# Altium schematic sheet FPGA_Banks2.SchDoc: FPGA Banks 2
size A4; Engineer: Samer Kilani; DocumentNumber: 7; SheetNumber: 7; SheetTotal: 9
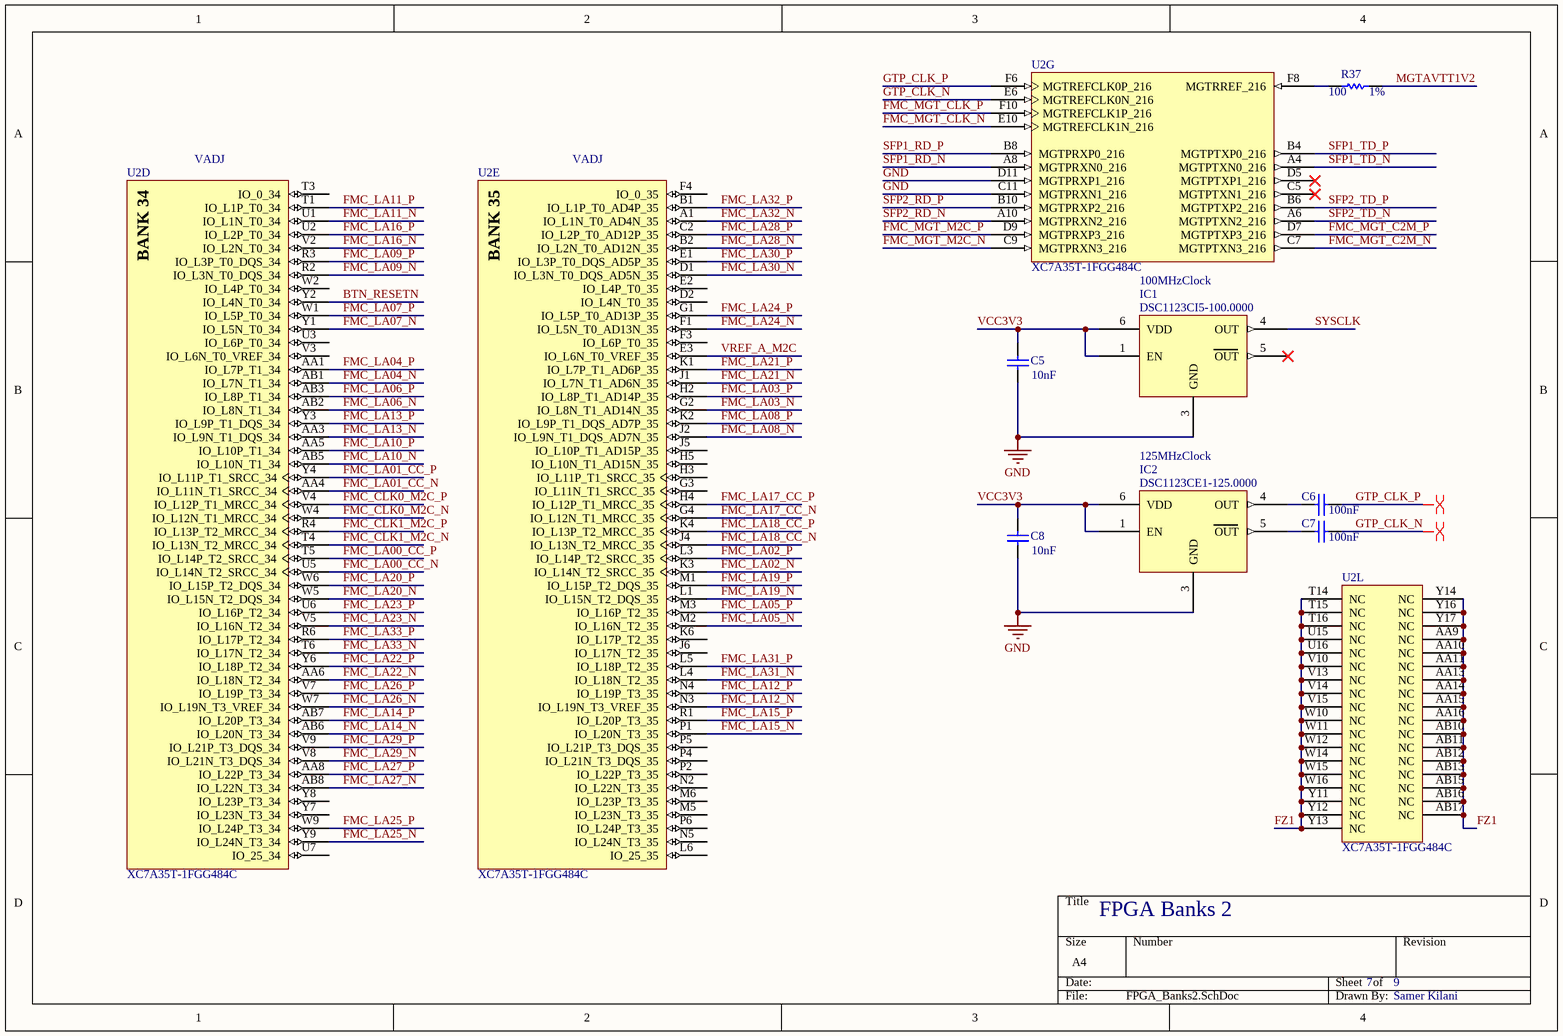
[diagram p0: FPGA_Banks2.SchDoc]

## Parts
C5  value 10nF  [C0402]  (hidden comment: Cap)
C6  value 100nF  [C0402]  (hidden comment: Cap)
C7  value 100nF  [C0402]  (hidden comment: Cap)
C8  value 10nF  [C0402]  (hidden comment: Cap)
IC1  DSC1123CI5-100.0000  [DSC1123_32_25]
IC2  DSC1123CE1-125.0000  [DSC1123_32_25]
R37  value 100  Tolerance: 1%  [R0402]  (hidden comment: Res)
U2  XC7A35T-1FGG484C  [FGG484]  (parts D,E,G,L of 12)

## Nets
GND: C5.1 C8.1 IC1.3(GND) IC2.3(GND) U2.C11(MGTPRXN1_216) U2.D11(MGTPRXP1_216)
BTN_RESETN: U2.Y2(IO_L4N_T0_34)
FMC_CLK0_M2C_N: U2.W4(IO_L12N_T1_MRCC_34)
FMC_CLK0_M2C_P: U2.V4(IO_L12P_T1_MRCC_34)
FMC_CLK1_M2C_N: U2.T4(IO_L13N_T2_MRCC_34)
FMC_CLK1_M2C_P: U2.R4(IO_L13P_T2_MRCC_34)
FMC_LA00_CC_N: U2.U5(IO_L14N_T2_SRCC_34)
FMC_LA00_CC_P: U2.T5(IO_L14P_T2_SRCC_34)
FMC_LA01_CC_N: U2.AA4(IO_L11N_T1_SRCC_34)
FMC_LA01_CC_P: U2.Y4(IO_L11P_T1_SRCC_34)
FMC_LA02_N: U2.K3(IO_L14N_T2_SRCC_35)
FMC_LA02_P: U2.L3(IO_L14P_T2_SRCC_35)
FMC_LA03_N: U2.G2(IO_L8N_T1_AD14N_35)
FMC_LA03_P: U2.H2(IO_L8P_T1_AD14P_35)
FMC_LA04_N: U2.AB1(IO_L7N_T1_34)
FMC_LA04_P: U2.AA1(IO_L7P_T1_34)
FMC_LA05_N: U2.M2(IO_L16N_T2_35)
FMC_LA05_P: U2.M3(IO_L16P_T2_35)
FMC_LA06_N: U2.AB2(IO_L8N_T1_34)
FMC_LA06_P: U2.AB3(IO_L8P_T1_34)
FMC_LA07_N: U2.Y1(IO_L5N_T0_34)
FMC_LA07_P: U2.W1(IO_L5P_T0_34)
FMC_LA08_N: U2.J2(IO_L9N_T1_DQS_AD7N_35)
FMC_LA08_P: U2.K2(IO_L9P_T1_DQS_AD7P_35)
FMC_LA09_N: U2.R2(IO_L3N_T0_DQS_34)
FMC_LA09_P: U2.R3(IO_L3P_T0_DQS_34)
FMC_LA10_N: U2.AB5(IO_L10N_T1_34)
FMC_LA10_P: U2.AA5(IO_L10P_T1_34)
FMC_LA11_N: U2.U1(IO_L1N_T0_34)
FMC_LA11_P: U2.T1(IO_L1P_T0_34)
FMC_LA12_N: U2.N3(IO_L19N_T3_VREF_35)
FMC_LA12_P: U2.N4(IO_L19P_T3_35)
FMC_LA13_N: U2.AA3(IO_L9N_T1_DQS_34)
FMC_LA13_P: U2.Y3(IO_L9P_T1_DQS_34)
FMC_LA14_N: U2.AB6(IO_L20N_T3_34)
FMC_LA14_P: U2.AB7(IO_L20P_T3_34)
FMC_LA15_N: U2.P1(IO_L20N_T3_35)
FMC_LA15_P: U2.R1(IO_L20P_T3_35)
FMC_LA16_N: U2.V2(IO_L2N_T0_34)
FMC_LA16_P: U2.U2(IO_L2P_T0_34)
FMC_LA17_CC_N: U2.G4(IO_L12N_T1_MRCC_35)
FMC_LA17_CC_P: U2.H4(IO_L12P_T1_MRCC_35)
FMC_LA18_CC_N: U2.J4(IO_L13N_T2_MRCC_35)
FMC_LA18_CC_P: U2.K4(IO_L13P_T2_MRCC_35)
FMC_LA19_N: U2.L1(IO_L15N_T2_DQS_35)
FMC_LA19_P: U2.M1(IO_L15P_T2_DQS_35)
FMC_LA20_N: U2.W5(IO_L15N_T2_DQS_34)
FMC_LA20_P: U2.W6(IO_L15P_T2_DQS_34)
FMC_LA21_N: U2.J1(IO_L7N_T1_AD6N_35)
FMC_LA21_P: U2.K1(IO_L7P_T1_AD6P_35)
FMC_LA22_N: U2.AA6(IO_L18N_T2_34)
FMC_LA22_P: U2.Y6(IO_L18P_T2_34)
FMC_LA23_N: U2.V5(IO_L16N_T2_34)
FMC_LA23_P: U2.U6(IO_L16P_T2_34)
FMC_LA24_N: U2.F1(IO_L5N_T0_AD13N_35)
FMC_LA24_P: U2.G1(IO_L5P_T0_AD13P_35)
FMC_LA25_N: U2.Y9(IO_L24N_T3_34)
FMC_LA25_P: U2.W9(IO_L24P_T3_34)
FMC_LA26_N: U2.W7(IO_L19N_T3_VREF_34)
FMC_LA26_P: U2.V7(IO_L19P_T3_34)
FMC_LA27_N: U2.AB8(IO_L22N_T3_34)
FMC_LA27_P: U2.AA8(IO_L22P_T3_34)
FMC_LA28_N: U2.B2(IO_L2N_T0_AD12N_35)
FMC_LA28_P: U2.C2(IO_L2P_T0_AD12P_35)
FMC_LA29_N: U2.V8(IO_L21N_T3_DQS_34)
FMC_LA29_P: U2.V9(IO_L21P_T3_DQS_34)
FMC_LA30_N: U2.D1(IO_L3N_T0_DQS_AD5N_35)
FMC_LA30_P: U2.E1(IO_L3P_T0_DQS_AD5P_35)
FMC_LA31_N: U2.L4(IO_L18N_T2_35)
FMC_LA31_P: U2.L5(IO_L18P_T2_35)
FMC_LA32_N: U2.A1(IO_L1N_T0_AD4N_35)
FMC_LA32_P: U2.B1(IO_L1P_T0_AD4P_35)
FMC_LA33_N: U2.T6(IO_L17N_T2_34)
FMC_LA33_P: U2.R6(IO_L17P_T2_34)
FMC_MGT_C2M_N: U2.C7(MGTPTXN3_216)
FMC_MGT_C2M_P: U2.D7(MGTPTXP3_216)
FMC_MGT_CLK_N: U2.E10(MGTREFCLK1N_216)
FMC_MGT_CLK_P: U2.F10(MGTREFCLK1P_216)
FMC_MGT_M2C_N: U2.C9(MGTPRXN3_216)
FMC_MGT_M2C_P: U2.D9(MGTPRXP3_216)
FZ1: U2.AA9(NC) U2.AA10(NC) U2.AA11(NC) U2.AA13(NC) U2.AA14(NC) U2.AA15(NC) U2.AA16(NC) U2.AB10(NC) U2.AB11(NC) U2.AB12(NC) U2.AB13(NC) U2.AB15(NC) U2.AB16(NC) U2.AB17(NC) U2.T14(NC) U2.T15(NC) U2.T16(NC) U2.U15(NC) U2.U16(NC) U2.V10(NC) U2.V13(NC) U2.V14(NC) U2.V15(NC) U2.W10(NC) U2.W11(NC) U2.W12(NC) U2.W14(NC) U2.W15(NC) U2.W16(NC) U2.Y11(NC) U2.Y12(NC) U2.Y13(NC) U2.Y14(NC) U2.Y16(NC) U2.Y17(NC)
GTP_CLK_N: C7.2 U2.E6(MGTREFCLK0N_216)
GTP_CLK_P: C6.2 U2.F6(MGTREFCLK0P_216)
MGTAVTT1V2: R37.1
SFP1_RD_N: U2.A8(MGTPRXN0_216)
SFP1_RD_P: U2.B8(MGTPRXP0_216)
SFP1_TD_N: U2.A4(MGTPTXN0_216)
SFP1_TD_P: U2.B4(MGTPTXP0_216)
SFP2_RD_N: U2.A10(MGTPRXN2_216)
SFP2_RD_P: U2.B10(MGTPRXP2_216)
SFP2_TD_N: U2.A6(MGTPTXN2_216)
SFP2_TD_P: U2.B6(MGTPTXP2_216)
SYSCLK: IC1.4(OUT)
VCC3V3: C5.2 C8.2 IC1.1(EN) IC1.6(VDD) IC2.1(EN) IC2.6(VDD)
VREF_A_M2C: U2.E3(IO_L6N_T0_VREF_35)
NetC6_1: C6.1 IC2.4(OUT)
NetC7_1: C7.1 IC2.5(OUT)
NetR37_2: R37.2 U2.F8(MGTRREF_216)

Not connected (* = marked no-connect by the designer): IC1 5(OUT)*; U2 C5(MGTPTXN1_216)* D2(IO_L4N_T0_35) D5(MGTPTXP1_216)* E2(IO_L4P_T0_35) F3(IO_L6P_T0_35) F4(IO_0_35) G3(IO_L11N_T1_SRCC_35) H3(IO_L11P_T1_SRCC_35) H5(IO_L10N_T1_AD15N_35) J5(IO_L10P_T1_AD15P_35) J6(IO_L17N_T2_35) K6(IO_L17P_T2_35) L6(IO_25_35) M5(IO_L23N_T3_35) M6(IO_L23P_T3_35) N2(IO_L22N_T3_35) N5(IO_L24N_T3_35) P2(IO_L22P_T3_35) P4(IO_L21N_T3_DQS_35) P5(IO_L21P_T3_DQS_35) P6(IO_L24P_T3_35) T3(IO_0_34) U3(IO_L6P_T0_34) U7(IO_25_34) V3(IO_L6N_T0_VREF_34) W2(IO_L4P_T0_34) Y7(IO_L23N_T3_34) Y8(IO_L23P_T3_34)

## Layout directives
differential pair: GTP_CLK_N, GTP_CLK_P

## Notes on the sheet
- VADJ
- 100MHzClock
- 125MHzClock
- (in symbol XC7A35T-1FGG484C, part D) BANK 34
- (in symbol XC7A35T-1FGG484C, part E) BANK 35

## Library data of the parts
C5-C8 = Cap: Capacitor; Published: 8-Jun-2000; LatestRevisionDate: 17-Jul-2002; LatestRevisionNote: Re-released for DXP Platform.; PackageReference: RAD-0.3; Publisher: Altium Limited; PackageDescription: Radial Cap, Thru-Hole; 2 Leads; 0.3 in Pin Spacing
IC1 IC2 = DSC1123: Standard Clock Oscillators Oscillator Hi Perf -20C-70C 50ppm
  IC1: PartNo: DSC1123CI5-100.0000
  IC2: PartNo: DSC1123CE1-125.0000
R37 = Res: Resistor
U2 = XC7A35T-1FGG484C: Artix-7 FPGA, 250 User I/Os, 4 GTP, 484-Ball BGA, Speed Grade 1, Commercial Grade, Pb-Free; Manufacturer: Xilinx; Total Block RAM: 1800 Kb; GTP: 4; Clock Mgmt Tiles (CMTs): 5; Logic Cells: 33280; Available User I/O: 250; Speed Grades: 1; DatasheetVersion: v1.15; PackageVersion: Rev. 1.11; PackageReference: FGG484; PackageDescription: 484-Ball Wire-Bond Fine-Pitch BGA, Body 23 x 23 mm, Pitch 1 mm; Maximum Distributed RAM: 400 Kb; Operating Temperature Range: Commercial; NexusDeviceID: XC7A35T-1FGG484C; Mounting Technology: Surface Mount; PartNumber: XC7A35T-1FGG484C; ComponentLink1Description: Manufacturer URL; ComponentLink1URL: http://www.xilinx.com/; ComponentLink2Description: Datasheet; ComponentLink2URL: http://www.xilinx.com/support/documentation/data_sheets/ds180_7Series_Overview.pdf; ComponentLink3Description: Package Specification; ComponentLink3URL: http://www.xilinx.com/support/documentation/user_guides/ug475_7Series_Pkg_Pinout.pdf; ComponentLink4Description: DC and Switching Characteristics; ComponentLink4URL: http://www.xilinx.com/support/documentation/data_sheets/ds181_Artix_7_Data_Sheet.pdf; ComponentLink5Description: Package File; ComponentLink5URL: http://www.xilinx.com/support/packagefiles/a7packages/xc7a200tsbg484pkg.txt; ComponentLink6Description: Packaging and Pinout; ComponentLink6URL: http://www.xilinx.com/support/documentation/user_guides/ug475_7Series_Pkg_Pinout.pdf